# Altium schematic sheet EMI Filter.SchDoc
size A; SheetNumber: 3; SheetTotal: 9
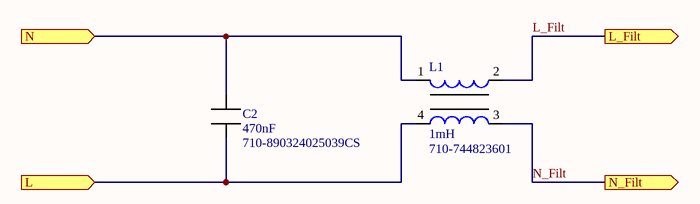
[diagram p0: EMI Filter.SchDoc]

## Parts
C2  470nF  Supplier Part Number 1: 710-890324025039CS  [890324025039CS]
L1  1mH  Supplier Part Number 1: 710-744823601  [744823601]

## Ports
L (in), L_Filt (out), N (in), N_Filt (out)

## Nets
L: C2.1 L1.4 ; port L
L_Filt: L1.2 ; port L_Filt
N: C2.2 L1.1 ; port N
N_Filt: L1.3 ; port N_Filt

## Library data of the parts
C2 = 890324025039CS: Safety Capacitors WCAP-FTX2 20mm Lead 0.47uF 10% 275VAC; Supplier 1: Mouser
L1 = 744823601: Common Mode Chokes / Filters WE-CMB Choke Type M 1mH 6A 13mOhm; Supplier 1: Mouser